# Altium project BlueFlower POT ver 2.0.PrjPcb
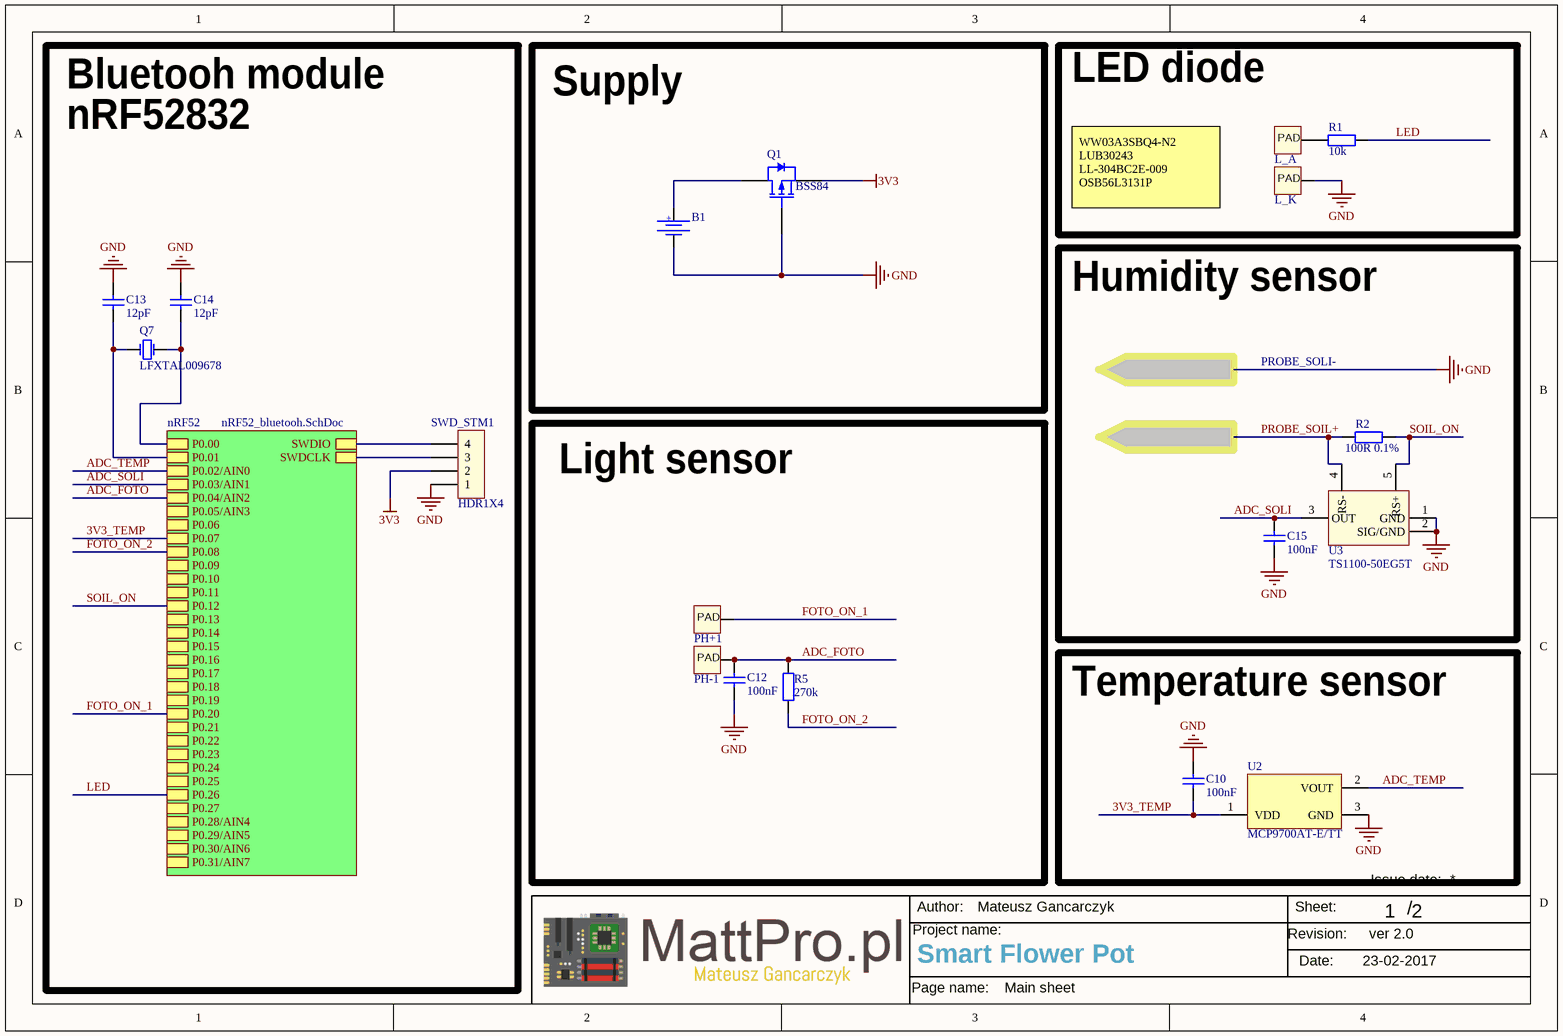
[diagram p0: BlueFlower POT.SchDoc]
2 sheets, 33 parts. Net scope: hierarchical (ports join the sheet entries above them; power ports are global).
Board file: BlueFlower POT.PcbDoc
Sheets:
  BlueFlower POT.SchDoc
    nRF52 = nRF52_bluetooh.SchDoc

## Sheet BlueFlower POT.SchDoc: Arkusz główny
size A4; Date: 23-02-2017; Author: Mateusz Gancarczyk; Revision: ver 2.0; SheetNumber: 1; SheetTotal: 2; PageSetup: Record=PageOptions|CenterHorizontal=True|CenterVertical=True|PrintScale=1.00|XCorrection=1.00|YCorrection=1.00|PrintKind=0|BorderSize=5000000|LeftOffset=0|BottomOffset=0|Orientation=2|PaperLength=1000|PaperWidth=1000|Scale=100|PaperSource=7|PrintQuality=-4|MediaType=1|DitherType=10|PaperKind=A3 (297 x 420 mm)|PrintScaleMode=0; NameOfProject: Smart Flower Pot; NameOfSheet: Main sheet; ProjectName: Projekt XXX

### Parts
B1  BC-2001  [CR2032_HOLDER_SMD]  (value not drawn)
C10  Wartość: 100nF  [SMD 0603S - CAPACITOR]  (hidden comment: 0603 100nF 20V)
C12  Wartość: 100nF  [SMD 0603S - CAPACITOR]  (hidden comment: 0603 100nF 20V)
C13  Wartość: 12pF  [SMD 0603S - CAPACITOR]  (hidden comment: 0603 12pF 20V)
C14  Wartość: 12pF  [SMD 0603S - CAPACITOR]  (hidden comment: 0603 12pF 20V)
C15  Wartość: 100nF  [SMD 0603S - CAPACITOR]  (hidden comment: 0603 100nF 20V)
L_A  Pad lutowniczy  [PAD_3x0.8mm]  (value not drawn)  (no BOM)
L_K  Pad lutowniczy  [PAD_3x0.8mm]  (value not drawn)  (no BOM)
PH+1  Pad lutowniczy  [PAD_3x0.8mm]  (value not drawn)  (no BOM)
PH-1  Pad lutowniczy  [PAD_3x0.8mm]  (value not drawn)  (no BOM)
Q1  BSS84  [SOT-23A]
Q7  LFXTAL009678  [Kwarc SMD 3.2 na 1.5mm]
R1  Wartosc: 10k  [SMD 0603]  (hidden comment: 0603 10k 1% 0.25W)
R2  Wartosc: 100R 0.1%  [SMD 0805]  (hidden comment: 0805 100R 0.1% 0.25W)
R5  Wartosc: 270k  [SMD 0603]  (hidden comment: 0603 270k 1% 0.25W)
SWD_STM1  HDR1X4  [HDR1x4_1.27mm]
U2  MCP9700AT-E/TT  [SOT-23-TT3_N]
U3  TS1100-50EG5T  [SOT-23]

### Blocks framed on the sheet
Supply: B1 Q1
LED diode: L_A L_K R1
Humidity sensor: C15 R2 U3
Light sensor: C12 PH+1 PH-1 R5
Temperature sensor: C10 U2

### Sub-sheets
nRF52 = nRF52_bluetooh.SchDoc: P0.00, P0.01, P0.02/AIN0, P0.03/AIN1, P0.04/AIN2, P0.05/AIN3, P0.06, P0.07, P0.08, P0.09, P0.10, P0.11, P0.12, P0.13, P0.14, P0.15, P0.16, P0.17, P0.18, P0.19, P0.20, P0.21, P0.22, P0.23, P0.24, P0.25, P0.26, P0.27, P0.28/AIN4, P0.29/AIN5, P0.30/AIN6, P0.31/AIN7, SWDIO, SWDCLK

### Nets
3V3: Q1.2(S) SWD_STM1.2
GND: B1.2 C10.2 C12.1 C13.2 C14.2 C15.1 L_K.1 Q1.1(G) SWD_STM1.1 U2.3(GND) U3.1(GND) U3.2(SIG/GND)
0.00_32kHZ: C14.1 Q7.2 ; sheet nRF52/P0.00
0.01_32kHZ: C13.1 Q7.1 ; sheet nRF52/P0.01
3V3_TEMP: C10.1 U2.1(VDD) ; sheet nRF52/P0.07  [project net 0.07]
ADC_FOTO: C12.2 PH-1.1 R5.1 ; sheet nRF52/P0.04/AIN2  [project net 0.04]
ADC_SOLI: C15.2 U3.3(OUT) ; sheet nRF52/P0.03/AIN1  [project net 0.03]
ADC_TEMP: U2.2(VOUT) ; sheet nRF52/P0.02/AIN0  [project net 0.02]
FOTO_ON_1: PH+1.1 ; sheet nRF52/P0.20  [project net 0.20]
FOTO_ON_2: R5.2 ; sheet nRF52/P0.08  [project net 0.08]
LED: R1.2 ; sheet nRF52/P0.26  [project net 0.26]
nRF_SWDCLK: SWD_STM1.3 ; sheet nRF52/SWDCLK
nRF_SWDIO: SWD_STM1.4 ; sheet nRF52/SWDIO
PROBE_SOIL+: R2.1 U3.4(RS-)
SOIL_ON: R2.2 U3.5(RS+) ; sheet nRF52/P0.12  [project net 0.12]
NetB1_1: B1.1 Q1.3(D)
NetL_A_1: L_A.1 R1.1

### Notes on the sheet
- Bluetooh module
- nRF52832
- WW03A3SBQ4-N2
  LUB30243
  LL-304BC2E-009
  OSB56L3131P
- PROBE_SOLI-
- TEPT4400
  Uzupełniamy nasz algorytm pomiaru:
  włączamy czujnik ustawiając pin PC0 jako wyjście i podajemy na niego jedynkę logiczną,
  włączamy masę rezystora ustawiając PC2 jako wyjście i podajemy na niego zero logiczne,
  czekamy chwilkę na ustabilizowanie się napięcia na kondensatorze,
  dokonujemy pomiaru pinu ADC1,
  po zakończonym pomiarze wyłączamy czujnik poprzez ustawienie pinów zasilania i masy rezystora w stan wysokiej impedancji, czyli jako wejście z wyłączonym rezystorem pull-up.
  http://mikrokontrolery.blogspot.com/2011/04/SmartPIP-czujnik-swiatla-oszczedzanie-energii.html
- Author:
- Sheet:
- /
- Issue date:
- Project name:
- Date:
- Revision:
- Page name:
- (in symbol Battery) +
- (in symbol Pad) PAD

### Library data of the parts
B1 = Battery: Bat Holder CR2032 SMD; Manufacturer: Comfortable; 2nd source part number: 165-0693; Artikkelnr Noca: 55089011; Artikkelnr Simpro: N.A.; Part Number: Bat Holder CR2032 SMD; Manufacturer Part Number: BC-2001; Datasheet: \\hizz\pro\app9717\Datasheet\connectores\Comfortable\BC-2001.pdf; Footprint Doc: CR2032_HOLDER_SMD; LatestRevisionDate: 2016-04-21; Pin Count: 3; Publisher: Nordic Semiconductor; Published: 2009-12-12; Value: Bat Holder CR2032; Note: Bat Holder CR2032; Supplier: Cabcon; Supplier part number: BC-2001/T & R; 2nd source Supplier: Farnell
C10 C12-C15 = Kondensator SMD: Kondensator
L_A L_K PH+1 PH-1 = Pad
Q1 = BSS84: Tranzystor MOSFET kanał P; Typ obudowy: SOT23; Published: 17-Sep-2003; LatestRevisionDate: 12-Dec-2006; LatestRevisionNote: IPC-7351 Footprint Added.; DatasheetVersion: 18-Jun-1997; PackageVersion: May-1999; PackageReference: SOT23; Publisher: Altium Limited; PackageDescription: 3-Pin SOT-23 Package 0.95 mm Pitch, 2.3 mm Lead Span; ComponentLink1Description: Manufacturer Link; ComponentLink1URL: http://www.semiconductors.philips.com/; ComponentLink2Description: Datasheet; ComponentLink2URL: http://www.semiconductors.philips.com/acrobat/datasheets/BSS84_3.pdf; Opis: Tranzystor MOSFET kanał P; Wartość: BSS84
Q7 = LFXTAL009678: Kwarc 32kHz SMD
R1 R2 R5 = Rezystor SMD: Rezystor
SWD_STM1 = HDR1X4: Pin header 1x4
U2 = MCP9700AT-E/TT: Czujnik Temperatury; Manufacturer: Microchip; DatasheetVersion: revE, Apr-2009; PackageVersion: revBB, Aug-2009; PackageReference: SOT-23-TT3; PackageDescription: 3-Lead Plastic Small Outline Transistor (TT) [SOT-23]; Supplier 1: Digi-Key; Supplier Part Number 1: MCP9700AT-E/TTTR-ND; Supplier 2: Digi-Key; Supplier Part Number 2: MCP9700AT-E/TTCT-ND; Supplier 3: Digi-Key; Supplier Part Number 3: MCP9700AT-E/TTDKR-ND; Supplier 4: Farnell; Supplier Part Number 4: 1605577RL; Supplier 5: Farnell; Supplier Part Number 5: 1605577; Supplier 6: Newark; Supplier Part Number 6: 84R5199; Supplier 7: Newark; Supplier Part Number 7: 17M0677; Supplier 8: Mouser; Supplier Part Number 8: 579-MCP9700AT-E/TT; Mounting Technology: Surface Mount; Code_IPC: SOT23-3; PartNumber: MCP9700AT-E/TT; ComponentLink1Description: Manufacturer URL; ComponentLink1URL: http://www.microchip.com/; ComponentLink2Description: Datasheet; ComponentLink2URL: http://ww1.microchip.com/downloads/en/DeviceDoc/21942e.pdf; ComponentLink3Description: Package Specification; ComponentLink3URL: http://www.microchip.com/stellent/groups/techpub_sg/documents/packagingspec/en012702.pdf
U3 = TS1100: Low-power current sense; Wartość: TS1100-50EG5T

## Sheet nRF52_bluetooh.SchDoc: Arkusz główny
size A4; ProjectNumber: 4397; PCBRevision: 0068KJP; DocumentSize: A4; PCAName: PCA10036; PCBNumber: 400118; Date: 23-02-2017; Author: Mateusz Gancarczyk; Revision: ver 2.0; SheetNumber: 2; SheetTotal: 2; PageSetup: Record=PageOptions|CenterHorizontal=True|CenterVertical=True|PrintScale=1.00|XCorrection=1.00|YCorrection=1.00|PrintKind=0|BorderSize=5000000|LeftOffset=0|BottomOffset=0|Orientation=2|PaperLength=1000|PaperWidth=1000|Scale=100|PaperSource=7|PrintQuality=-4|MediaType=1|DitherType=10|PaperKind=A3 (297 x 420 mm)|PrintScaleMode=0; NameOfProject: Smart Flower Pot; NameOfSheet: Bluetooth nRF52832; ProjectName: Projekt XXX
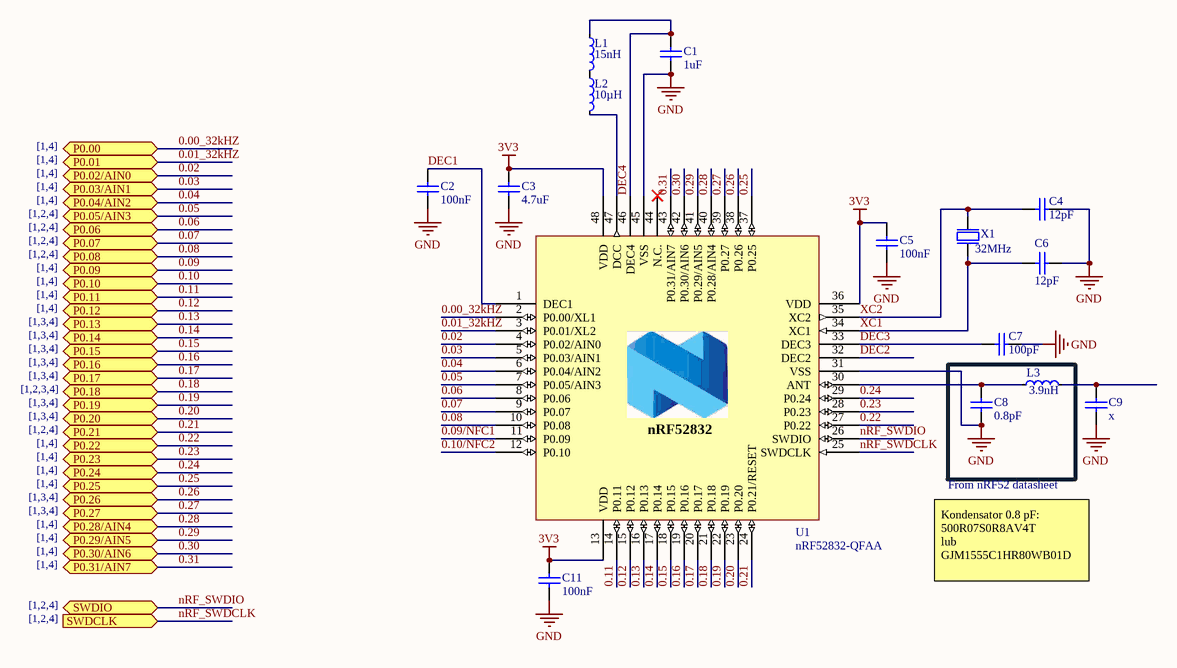
[diagram p1: nRF52_bluetooh.SchDoc]

### Parts
C1  Wartość: 1uF  [0603C-GENERIC]  (hidden comment: 0603 1uF 10V)
C2  Wartość: 100nF  [0603C-GENERIC]  (hidden comment: 0603 100nF 10V)
C3  Wartość: 4.7uF  [0603C-GENERIC]  (hidden comment: 0603 4.7uF 10V)
C4  Wartość: 12pF  [0603C-GENERIC]  (hidden comment: 0603 12pF 10V)
C5  Wartość: 100nF  [0603C-GENERIC]  (hidden comment: 0603 100nF 10V)
C6  Wartość: 12pF  [0603C-GENERIC]  (hidden comment: 0603 12pF 10V)
C7  Wartość: 100pF  [SMD 0402 - capacitor]  (hidden comment: 0402 100pF 10V)
C8  Wartość: 0.8pF  [SMD 0402 - capacitor]  (hidden comment: 0402 0.8pF 10V)
C9  Wartość: x  [SMD 0402 - capacitor]  (hidden comment: 0402 x 10V)
C11  Wartość: 100nF  [0603C-GENERIC]  (hidden comment: 0603 100nF 10V)
L1  value 15nH  [INDC1005X04L]  (hidden comment: HK100515NJ-T)
L2  value 10µH  [INDC1608X06L]  (hidden comment: LBMF1608T100K)
L3  value 3.9nH  [INDC1005X04L]  (hidden comment: LQP15MN3N9B02D)
U1  nRF52832-QFAA  [QFN40P600X600X90-48N]
X1  value 32MHz  [BT-XTAL_2016]  (hidden comment: Q22FA1280034112 lub 774-402F16011CAT)

### Ports
P0.00 (bidir), P0.01 (bidir), P0.02/AIN0 (bidir), P0.03/AIN1 (bidir), P0.04/AIN2 (bidir), P0.05/AIN3 (bidir), P0.06 (bidir), P0.07 (bidir), P0.08 (bidir), P0.09 (bidir), P0.10 (bidir), P0.11 (bidir), P0.12 (bidir), P0.13 (bidir), P0.14 (bidir), P0.15 (bidir), P0.16 (bidir), P0.17 (bidir), P0.18 (bidir), P0.19 (bidir), P0.20 (bidir), P0.21 (bidir), P0.22 (bidir), P0.23 (bidir), P0.24 (bidir), P0.25 (bidir), P0.26 (bidir), P0.27 (bidir), P0.28/AIN4 (bidir), P0.29/AIN5 (bidir), P0.30/AIN6 (bidir), P0.31/AIN7 (bidir), SWDCLK (in), SWDIO (bidir)

### Nets
3V3: C3.1 C5.1 C11.1 U1.13(VDD) U1.36(VDD) U1.48(VDD)
GND: C1.2 C2.2 C3.2 C4.1 C5.2 C6.1 C7.1 C8.2 C9.2 C11.2 U1.31(VSS) U1.45(VSS) U1.49(GND) X1.2(GND) X1.4(GND)
0.00_32kHZ: U1.2(P0.00/XL1) ; port P0.00
0.01_32kHZ: U1.3(P0.01/XL2) ; port P0.01
0.02: U1.4(P0.02/AIN0) ; port P0.02/AIN0
0.03: U1.5(P0.03/AIN1) ; port P0.03/AIN1
0.04: U1.6(P0.04/AIN2) ; port P0.04/AIN2
0.05: U1.7(P0.05/AIN3) ; port P0.05/AIN3
0.06: U1.8(P0.06) ; port P0.06
0.07: U1.9(P0.07) ; port P0.07
0.08: U1.10(P0.08) ; port P0.08
0.09: port P0.09
0.09/NFC1: U1.11(P0.09)
0.10: port P0.10
0.10/NFC2: U1.12(P0.10)
0.11: U1.14(P0.11) ; port P0.11
0.12: U1.15(P0.12) ; port P0.12
0.13: U1.16(P0.13) ; port P0.13
0.14: U1.17(P0.14) ; port P0.14
0.15: U1.18(P0.15) ; port P0.15
0.16: U1.19(P0.16) ; port P0.16
0.17: U1.20(P0.17) ; port P0.17
0.18: U1.21(P0.18) ; port P0.18
0.19: U1.22(P0.19) ; port P0.19
0.20: U1.23(P0.20) ; port P0.20
0.21: U1.24(P0.21/RESET) ; port P0.21
0.22: U1.27(P0.22) ; port P0.22
0.23: U1.28(P0.23) ; port P0.23
0.24: U1.29(P0.24) ; port P0.24
0.25: U1.37(P0.25) ; port P0.25
0.26: U1.38(P0.26) ; port P0.26
0.27: U1.39(P0.27) ; port P0.27
0.28: U1.40(P0.28/AIN4) ; port P0.28/AIN4
0.29: U1.41(P0.29/AIN5) ; port P0.29/AIN5
0.30: U1.42(P0.30/AIN6) ; port P0.30/AIN6
0.31: U1.43(P0.31/AIN7) ; port P0.31/AIN7
DEC1: C2.1 U1.1(DEC1)
DEC2: U1.32(DEC2)
DEC3: C7.2 U1.33(DEC3)
DEC4: C1.1 L1.1 U1.46(DEC4)
nRF_SWDCLK: U1.25(SWDCLK) ; port SWDCLK
nRF_SWDIO: U1.26(SWDIO) ; port SWDIO
XC1: C6.2 U1.34(XC1) X1.1(inp)
XC2: C4.2 U1.35(XC2) X1.3(out)
NetC8_1: C8.1 L3.1 U1.30(ANT)
NetC9_1: C9.1 L3.2
NetL1_2: L1.2 L2.1
NetL2_2: L2.2 U1.47(DCC)

Not connected (* = marked no-connect by the designer): U1 44(N.C.)*

### Notes on the sheet
- [1,4]
- [1,2,4]
- [1,3,4]
- [1,2,3,4]
- From nRF52 datasheet
- Kondensator 0.8 pF:
  500R07S0R8AV4T
  lub
  GJM1555C1HR80WB01D
- Author:
- Sheet:
- /
- Issue date:
- Project name:
- Date:
- Revision:
- Page name:
- (in symbol nRF52832-QFAA) nRF52832

### Library data of the parts
C1-C9 C11 = Kondensator SMD: Kondensator
L1 = L0402-15n: Dławik 15nH; Manufacturer: Taiyo Yuden; 2nd source part number: 658-1328; Note: High frequency chip inductor ±10%; Artikkelnr Noca: 33029323; Artikkelnr Simpro: N.A.; Part Number: L0402-15n; Manufacturer Part Number: HK100515NJ-T; LatestRevisionDate: 2012-09-19; Pin Count: 2; Publisher: Nordic Semiconductor; Published: 2010-07-12; Supplier: Digi-Key; Datasheet: http://www.yuden.co.jp/productdata/catalog/en/mlci04_e.pdf; Supplier part number: 587-1521-1-ND; 2nd source Supplier: Farnell; Footprint Doc: 0402
L2 = L0603-10µ: Dławik 10uH; Manufacturer: Taiyo Yuden; 2nd source part number: 178-6105; Note: LBMF1608T100K 10µH 80mA 0603; Artikkelnr Noca: 33029314; Artikkelnr Simpro: N.A.; Part Number: L0603-10µ; Manufacturer Part Number: LBMF1608T100K; Datasheet: http://www.yuden.co.jp/ut/product/pdf/elb2_e.pdf; LatestRevisionDate: 2012-09-19; Pin Count: 2; Publisher: Nordic Semiconductor; Published: 2010-02-24; Supplier: Digi-Key; Supplier part number: 587-1714-1-ND; 2nd source Supplier: Farnell; Footprint Doc: 0603
L3 = L0402-3n9: Dławik 3,9nH; Manufacturer: Murata; Note: High frequency chip inductor ±5%; Artikkelnr Noca: 33029151; Artikkelnr Simpro: N.A.; Part Number: L0402-3n9; Manufacturer Part Number: LQP15MN3N9B02D; Datasheet: http://search.murata.co.jp/Ceramy/image/img/PDF/ENG/L0075S0084LQP15M.pdf; LatestRevisionDate: 2012-09-19; Pin Count: 2; Publisher: Nordic Semiconductor; Published: 2009-05-08; Supplier: Digi-Key; Supplier part number: 490-1131-1-ND; 2nd source Supplier: *; 2nd source part number: *; Footprint Doc: 0402
U1 = nRF52832-QFAA: Multi-protocol Bluetooth Low Energy and 2.4GHz proprietary system-on-chip; Manufacturer: Nordic Semiconductor; Artikkelnr Noca: N.A.; Part Number: nRF52832-QFAA; Manufacturer Part Number: nRF52832-QFAA; Datasheet: *; LatestRevisionDate: 2014-11-26; Pin Count: 48; Publisher: Nordic Semiconductor; Published: 2014-11-26; Value: nRF52832-QFAA; Note: *; Supplier: Nordic Semiconductor; Supplier part number: *; 2nd source Supplier: *; 2nd source part number: *; Footprint Doc: QFN-48; Artikkelnr Simpro: N.A.
X1 = XTAL_SMD2016_32MHz_8pF_Epson: Kwarc 32MHz; Manufacturer: Epson Toyocom; Manufacturer Part Number: Q22FA12800025; Note: XTAL SMD 32.000MHz; Artikkelnr Noca: N.A.; Part Number: XTAL_SMD2016_32MHz_8pF_Epson; Datasheet: http://www.epsondevice.com/docs/qd/en/DownloadServlet?id=ID000449; LatestRevisionDate: 2014-11-27; Pin Count: 4; Publisher: Nordic Semiconductor; Published: 2012-03-09; Supplier: Farnell; Supplier part number: 171-2806; 2nd source Supplier: *; 2nd source part number: *; Footprint Doc: XTAL_2016; Artikkelnr Simpro: N.A.

## Nets that join several sheets
3V3: BlueFlower POT (Q1.2 SWD_STM1.2), nRF52_bluetooh (6 pins)
GND: BlueFlower POT (12 pins), nRF52_bluetooh (15 pins)
0.00_32kHZ: BlueFlower POT (C14.1 Q7.2), nRF52_bluetooh (U1.2)
0.01_32kHZ: BlueFlower POT (C13.1 Q7.1), nRF52_bluetooh (U1.3)
0.02: BlueFlower POT (U2.2), nRF52_bluetooh (U1.4)
0.03: BlueFlower POT (C15.2 U3.3), nRF52_bluetooh (U1.5)
0.04: BlueFlower POT (C12.2 PH-1.1 R5.1), nRF52_bluetooh (U1.6)
0.07: BlueFlower POT (C10.1 U2.1), nRF52_bluetooh (U1.9)
0.08: BlueFlower POT (R5.2), nRF52_bluetooh (U1.10)
0.12: BlueFlower POT (R2.2 U3.5), nRF52_bluetooh (U1.15)
0.20: BlueFlower POT (PH+1.1), nRF52_bluetooh (U1.23)
0.26: BlueFlower POT (R1.2), nRF52_bluetooh (U1.38)
nRF_SWDCLK: BlueFlower POT (SWD_STM1.3), nRF52_bluetooh (U1.25)
nRF_SWDIO: BlueFlower POT (SWD_STM1.4), nRF52_bluetooh (U1.26)